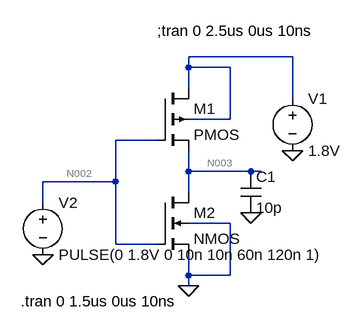
[diagram p0: schematic Draft2.asc]
Draft2.asc, the LTspice schematic file:
Version 4
SHEET 1 880 680
WIRE 320 0 160 0
WIRE 160 16 160 0
WIRE 224 16 160 16
WIRE 160 48 160 16
WIRE 320 64 320 0
WIRE 224 96 224 16
WIRE 224 96 160 96
WIRE 112 128 48 128
WIRE 160 176 160 144
WIRE 256 176 160 176
WIRE 272 176 256 176
WIRE 48 192 48 128
WIRE 48 192 -64 192
WIRE 160 208 160 176
WIRE -64 224 -64 192
WIRE 224 256 160 256
WIRE 48 288 48 192
WIRE 112 288 48 288
WIRE 160 336 160 304
WIRE 224 336 224 256
WIRE 224 336 160 336
WIRE 160 352 160 336
FLAG -64 304 0
FLAG 320 144 0
FLAG 160 352 0
FLAG 256 240 0
DATAFLAG 48 176 ""
SYMBOL pmos4 112 48 R0
SYMATTR InstName M1
SYMATTR Value2 l=180nm w=240nm
SYMBOL nmos4 112 208 R0
SYMATTR InstName M2
SYMATTR Value2 l=180nm w=240nm
SYMBOL voltage 320 48 R0
WINDOW 123 0 0 Left 0
WINDOW 39 0 0 Left 0
SYMATTR InstName V1
SYMATTR Value 1.8V
SYMBOL voltage -64 208 R0
WINDOW 123 0 0 Left 0
WINDOW 39 0 0 Left 0
SYMATTR InstName V2
SYMATTR Value PULSE(0 1.8V 0 10n 10n 60n 120n 1)
SYMBOL cap 240 176 R0
SYMATTR InstName C1
SYMATTR Value 10p
TEXT 112 -40 Left 2 !;tran 0 2.5us 0us 10ns
TEXT -98 376 Left 2 !.tran 0 1.5us 0us 10ns

The netlist it stands for:
* Draft2.asc
M1 N001 N002 N003 N001 PMOS l=180nm w=240nm
M2 N003 N002 0 0 NMOS l=180nm w=240nm
V1 N001 0 1.8V
V2 N002 0 PULSE(0 1.8V 0 10n 10n 60n 120n 1)
C1 N003 0 10p
.model NMOS NMOS
.model PMOS PMOS
.lib standard.mos
;tran 0 2.5us 0us 10ns
.tran 0 1.5us 0us 10ns
.backanno
.end

* Results of the author's LTspice run, read from the files saved beside the schematic
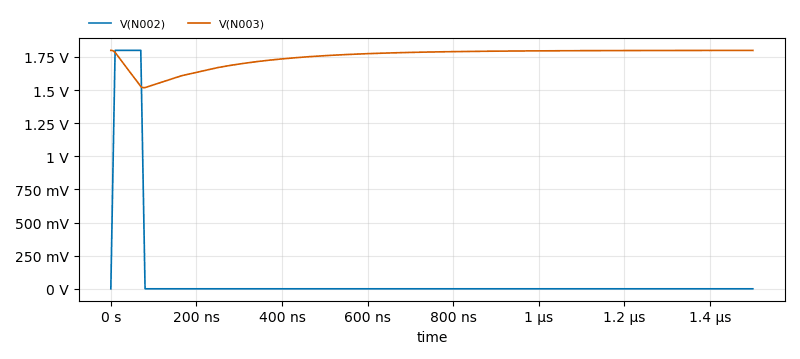
[diagram p1: Transient Analysis of Draft2.asc, plotted from the saved traces]
* Transient Analysis, 1 run:
*   V(N002): min 0 V, max 1.8 V, average 84 mV, rms 380.4 mV, last 0 V
*   V(N003): min 1.518 V, max 1.8 V, average 1.751 V, rms 1.753 V, last 1.8 V